# Altium schematic sheet joint_board_boosterpack_hall_effect_encoder.SchDoc
size A; DocumentNumber: 3
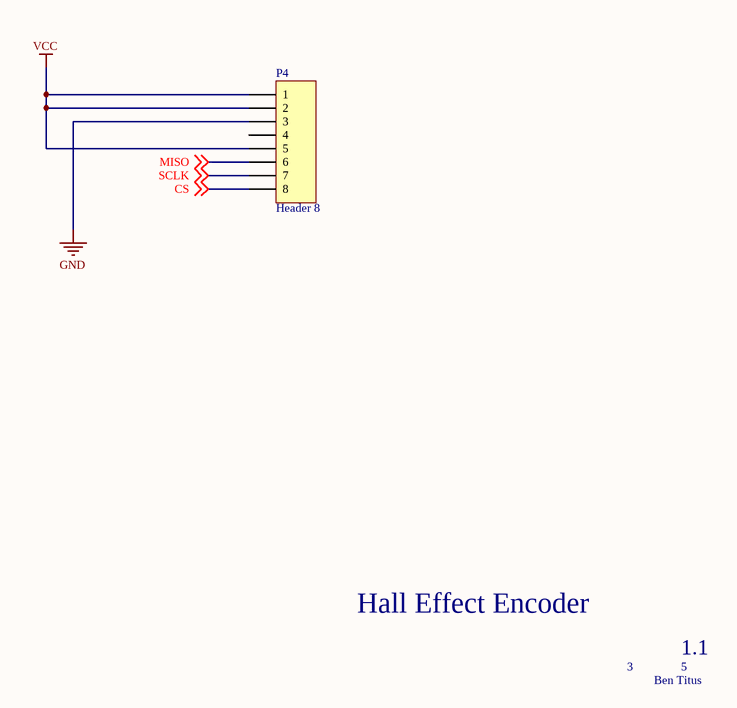
[diagram p0: joint_board_boosterpack_hall_effect_encoder.SchDoc]

## Parts
P4  Header 8  [HDR1X8]

## Nets
GND: P4.3
VCC: P4.1 P4.2 P4.5
CS: P4.8 ; off-sheet CS
MISO: P4.6 ; off-sheet MISO
SCLK: P4.7 ; off-sheet SCLK

Not connected (* = marked no-connect by the designer): P4 4

## Notes on the sheet
- Hall Effect Encoder
- 3
- 1.1
- 5
- Ben Titus

## Library data of the parts
P4 = Header 8: Header, 8-Pin; LatestRevisionDate: 17-Jul-2002; LatestRevisionNote: Re-released for DXP Platform.; Publisher: Altium Limited